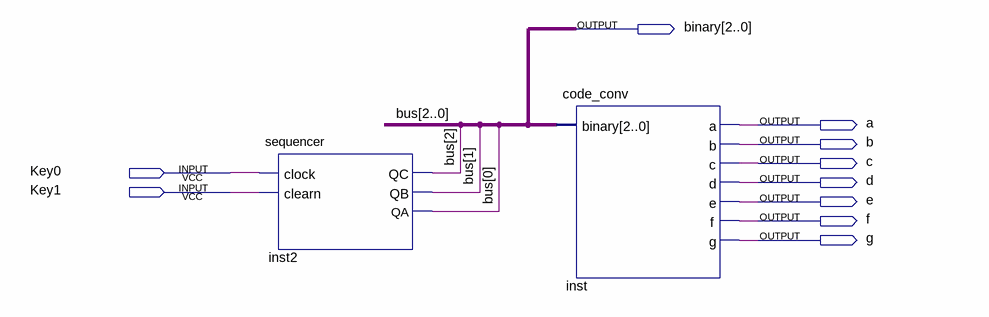
[diagram p0: schematic sheet]
// Quartus schematic Procedure_3.bdf as structural Verilog: 2 symbols, 10 pins
module Procedure_3 (
  input  Key0,
  input  Key1,
  output [2:0] binary,
  output a,
  output b,
  output c,
  output d,
  output e,
  output f,
  output g
);

  sequencer inst2 (.clock(Key0), .clearn(Key1), .QC(binary[2]), .QB(binary[1]), .QA(binary[0]));
  code_conv inst (.binary(binary), .a(a), .b(b), .c(c), .d(d), .e(e), .f(f), .g(g));

  // Other names for the same wires on the sheet: bus[2:0] = binary
endmodule
